# EAGLE design dials (EAGLE 9.6.2)
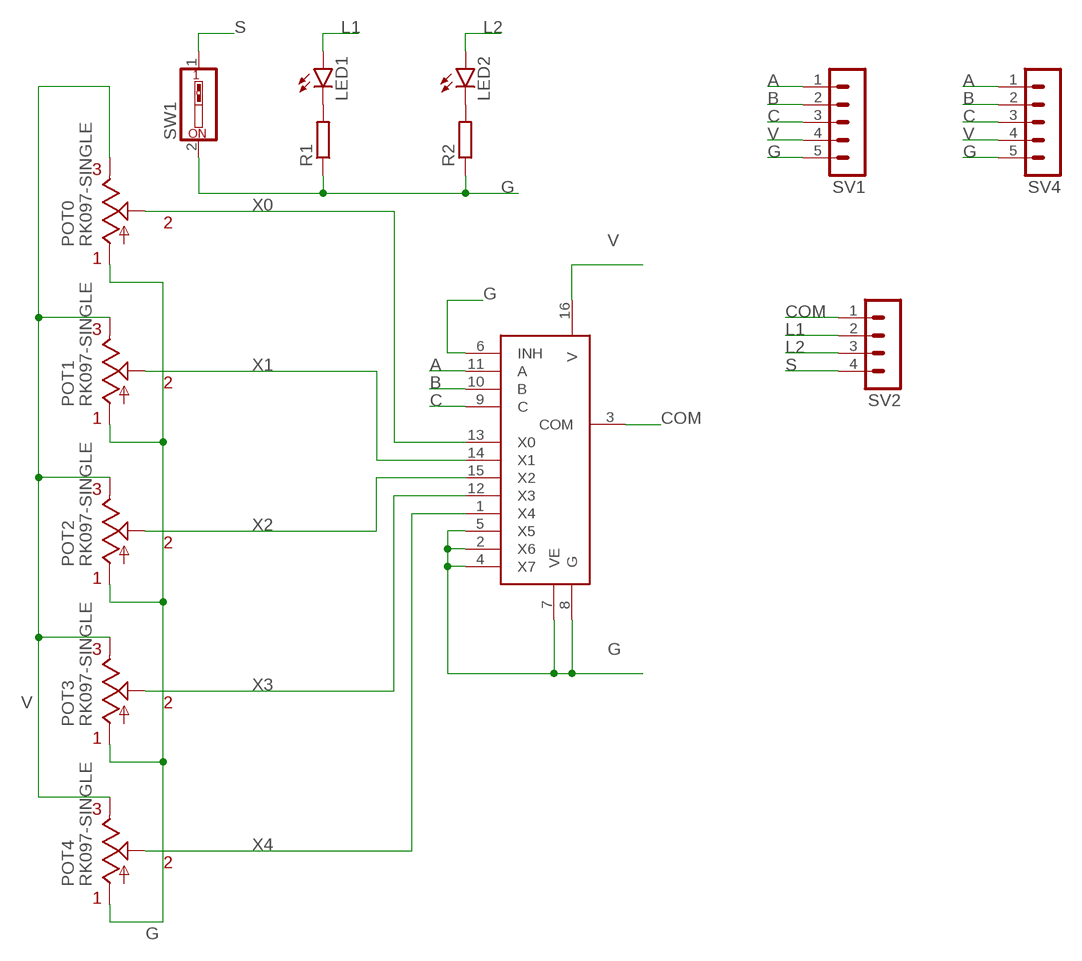
[diagram p0: schematic, sheet 1]

## Parts
LED1  LED3MM  [LED3MM]
LED2  LED3MM  [LED3MM]
POT0  RK097-SINGLE  [RK097-SINGLE-ELEMENT]
POT1  RK097-SINGLE  [RK097-SINGLE-ELEMENT]
POT2  RK097-SINGLE  [RK097-SINGLE-ELEMENT]
POT3  RK097-SINGLE  [RK097-SINGLE-ELEMENT]
POT4  RK097-SINGLE  [RK097-SINGLE-ELEMENT]
R1  R-EU_0204/7  [0204/7]
R2  R-EU_0204/7  [0204/7]
SV1  MA05-1  [MA05-1]
SV2  MA04-1  [MA04-1]
SV4  MA05-1  [MA05-1]
SW1  SW_DIP-1  [EDG-01]
U$6  MC14051  [DIP16]

## Nets
A: SV1.1 SV4.1 U$6.11(A)
B: SV1.2 SV4.2 U$6.10(B)
C: SV1.3 SV4.3 U$6.9(C)
COM: SV2.1 U$6.3(COM)
G: POT0.P$4(A) POT1.P$4(A) POT2.P$4(A) POT3.P$4(A) POT4.P$4(A) R1.1 R2.1 SV1.5 SV4.5 SW1.2 U$6.2(X6) U$6.4(X7) U$6.5(X5) U$6.6(INH) U$6.7(VE) U$6.8(G)
L1: LED1.A SV2.2
L2: LED2.A SV2.3
N$6: LED1.K(C) R1.2
N$7: LED2.K(C) R2.2
S: SV2.4 SW1.1
V: POT0.P$6(E) POT1.P$6(E) POT2.P$6(E) POT3.P$6(E) POT4.P$6(E) SV1.4 SV4.4 U$6.16(V)
X0: POT0.P$5(S) U$6.13(X0)
X1: POT1.P$5(S) U$6.14(X1)
X2: POT2.P$5(S) U$6.15(X2)
X3: POT3.P$5(S) U$6.12(X3)
X4: POT4.P$5(S) U$6.1(X4)

## Library data of the parts
LED1 LED2 = led:LED: LED OSRAM: - CHIPLED LG R971, LG N971, LY N971, LG Q971, LY Q971, LO R971, LY R971 LH N974, LH R974 LS Q976, LO Q976, LY Q976 LO Q996 - Hyper CHIPLED LW Q18S LB Q993, LB Q99A, LB R99A - SideLED LS A670, LO A670, LY A670, LG A670, LP A670 LB A673, LV A673, LT A673, LW A673 LH A674 LY A675 LS A676, LA A676, LO A676, LY A676, LW A676 LS A679, LY A679, LG A679 - Hyper Micro SIDELED® LS Y876, LA Y876, LO Y876, LY Y876 LT Y87S - SmartLED LW L88C, LW L88S LB L89C, LB L89S, LG L890 LS L89K, LO L89K, LY L89K LS L896, LA L896, LO L896, LY L896 - TOPLED LS T670, LO T670, LY T670, LG T670, LP T670 LSG T670, LSP T670, LSY T670, LOP T670, LYG T670 LG T671, LOG T671, LSG T671 LB T673, LV T673, LT T673, LW T673 LH T674 LS T676, LA T676, LO T676, LY T676, LB T676, LH T676, LSB T676, LW T676 LB T67C, LV T67C, LT T67C, LS T67K, LO T67K, LY T67K, LW E67C LS E67B, LA E67B, LO E67B, LY E67B, LB E67C, LV E67C, LT E67C LW T67C LS T679, LY T679, LG T679 LS T770, LO T770, LY T770, LG T770, LP T770 LB T773, LV T773, LT T773, LW T773 LH T774 LS E675, LA E675, LY E675, LS T675 LS T776, LA T776, LO T776, LY T776, LB T776 LHGB T686 LT T68C, LB T68C - Hyper Mini TOPLED® LB M676 - Mini TOPLED Santana® LG M470 LS M47K, LO M47K, LY M47K Source: http://www.osram.convergy.de LUXEON: - LUMILED® LXK2-PW12-R00, LXK2-PW12-S00, LXK2-PW14-U00, LXK2-PW14-V00 LXK2-PM12-R00, LXK2-PM12-S00, LXK2-PM14-U00 LXK2-PE12-Q00, LXK2-PE12-R00, LXK2-PE12-S00, LXK2-PE14-T00, LXK2-PE14-U00 LXK2-PB12-K00, LXK2-PB12-L00, LXK2-PB12-M00, LXK2-PB14-N00, LXK2-PB14-P00, LXK2-PB14-Q00 LXK2-PR12-L00, LXK2-PR12-M00, LXK2-PR14-Q00, LXK2-PR14-R00 LXK2-PD12-Q00, LXK2-PD12-R00, LXK2-PD12-S00 LXK2-PH12-R00, LXK2-PH12-S00 LXK2-PL12-P00, LXK2-PL12-Q00, LXK2-PL12-R00 Source: www.luxeon.com KINGBRIGHT: KA-3528ASYC Source: www.kingbright.com
POT0 POT1-POT4 = alps_japan_potentiometers:RK097-SINGLE: SCHEMATIC FOR POTENTIOMETER
R1 R2 = rcl:R-EU_: RESISTOR, European symbol; SPICEPREFIX: R
SV1 SV4 = con-lstb:MA05-1: PIN HEADER; OC_FARNELL: unknown; OC_NEWARK: unknown
SV2 = con-lstb:MA04-1: PIN HEADER; OC_FARNELL: unknown; OC_NEWARK: unknown
SW1 = special:SW_DIP-1: DIP SWITCH
U$6 = MC14051B:MC14051

## Board
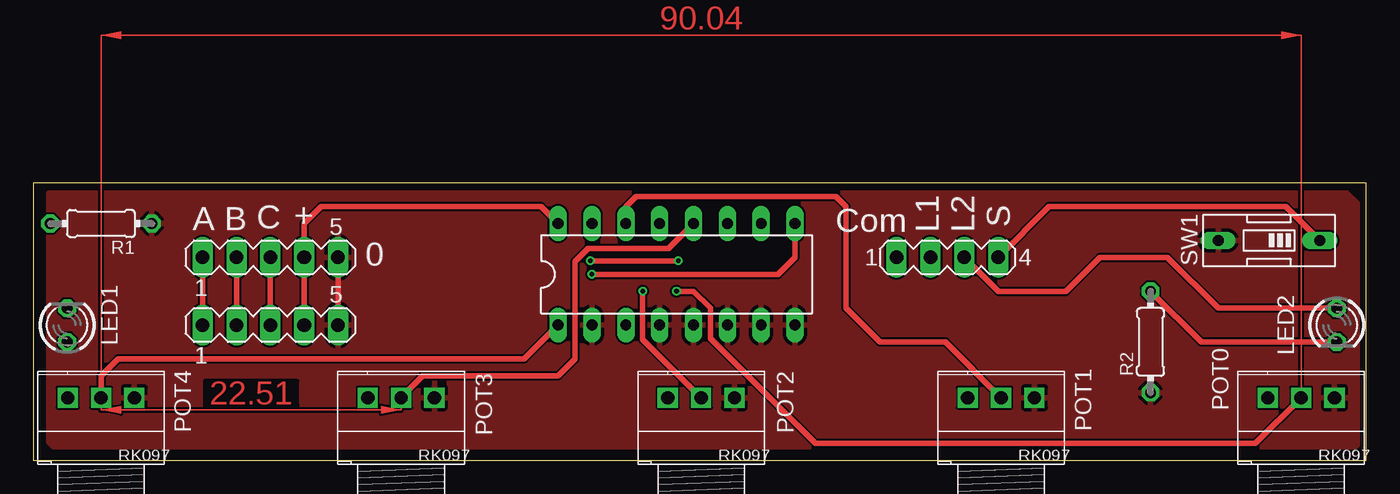
[diagram p1: board, top side]
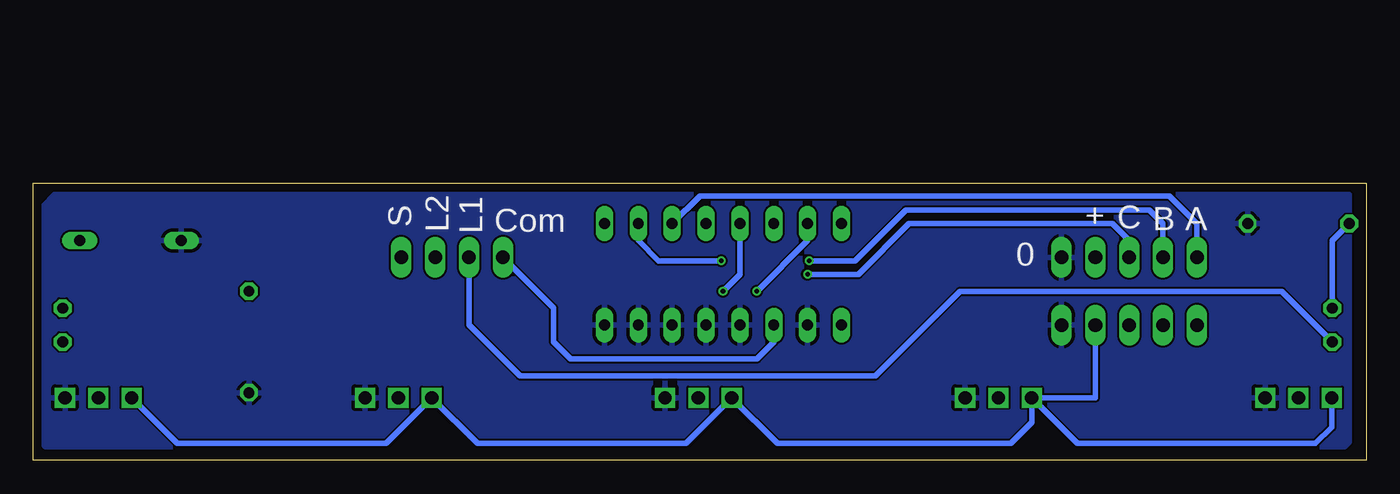
[diagram p2: board, bottom side, seen from below]

Size 100 x 20.82 mm. Coordinates in mm from the lower left corner, seen from the top.
Outline: 0,0 100,0 100,20.82 0,20.82 0,0
Copper layers (1*16): Top 0.035mm / dielectric 1.5mm / Bottom 0.035mm
Design rules "SeeedStudio_2layer_DRU_no_angle_20140221": minimum track width 6mil, minimum drill 12mil, track to track 6mil, track to pad 6mil, pad to pad 6mil, via to via 6mil, smd to smd 0mil, copper to edge 10mil, drill to drill 10mil, minimum pad ring 10mil, minimum via ring 6mil, stop-mask expansion 2mil, vias tented up to drill 100mil, thermal gap 10mil

### Footprints (pad centres in the part's own frame; a part is rotated, then mirrored left to right if it is on the bottom)
LED3MM = drill 0.813 octagon: A -1.27,0; K 1.27,0
RK097-SINGLE-ELEMENT = drill 1 pad 1.422 square: P$4 2.5,0; P$5 0,0; P$6 -2.5,0
0204/7 = drill 0.813 octagon: 1 -3.81,0; 2 3.81,0
MA05-1 = drill 1.016 long: 1 -5.08,0; 2 -2.54,0; 3 0,0; 4 2.54,0; 5 5.08,0
MA04-1 = drill 1.016 long: 1 -3.81,0; 2 -1.27,0; 3 1.27,0; 4 3.81,0
EDG-01 = drill 0.813 long: 1 0,-3.81; 2 0,3.81
DIP16 = drill 0.813 long: 1 -10.16,-3.81; 2 -7.62,-3.81; 3 -5.08,-3.81; 4 -2.54,-3.81; 5 0,-3.81; 6 2.54,-3.81; 7 5.08,-3.81; 8 7.62,-3.81; 9 7.62,3.81; 10 5.08,3.81; 11 2.54,3.81; 12 0,3.81; 13 -2.54,3.81; 14 -5.08,3.81; 15 -7.62,3.81; 16 -10.16,3.81

### Placement (x,y rotation side)
LED1  2.54,10.16 90 top
LED2  97.79,10.16 270 top
POT0  95.12,4.7 0 top
POT1  72.61,4.7 0 top
POT2  50.1,4.7 0 top
POT3  27.59,4.7 0 top
POT4  5.08,4.7 0 top
R1  5.08,17.78 180 top
R2  83.82,8.89 90 top
SV1  17.78,15.24 0 top
SV2  68.58,15.24 0 top
SV4  17.78,10.16 0 top
SW1  92.71,16.51 90 top
U$6  49.53,13.97 0 top

### Tracks (layer width: path | path; a pad name or v marks a point on that pad's centre or on a via)
A
  Top 0.406: SV1.1 SV4.1
  Bottom 0.406: SV1.1 12.7,17.78 14.77,19.85 50,19.85 U$6.11
B  (via drill 0.35)
  Top 0.406: SV1.2 SV4.2 | v48.39,14.99 v41.78,14.99
  Bottom 0.406: SV1.2 15.24,17.78 16.26,18.8 34.54,18.8 38.35,14.99 v41.78,14.99 | v48.39,14.99 53.09,14.99 54.61,16.51 U$6.10
C  (via drill 0.35)
  Top 0.406: SV1.3 SV4.3 | v41.91,13.97 55.88,13.97 57.15,15.24 U$6.9
  Bottom 0.406: SV1.3 17.78,16.51 19.05,17.78 34.29,17.78 38.1,13.97 v41.91,13.97
COM
  Bottom 0.406: SV2.1 60.96,11.43 60.96,8.89 59.69,7.62 45.72,7.62 44.45,8.89 U$6.3
G
  Top 0.406: SV1.5 SV4.5
  pour Bottom: 1.27,19.94 98.42,19.94 99.19,19.18 99.19,1.14 99.06,1.02 1.65,1.02 1.27,1.4
  pour Top: 1.14,20.07 98.55,20.07 99.31,19.3 99.31,1.14 99.19,1.02 1.52,1.02 1.14,1.4
L1
  Bottom 0.406: LED1.A 6.35,12.7 30.48,12.7 36.83,6.35 63.5,6.35 67.31,10.16 SV2.2
L2
  Top 0.406: SV2.3 72.39,12.7 77.47,12.7 80.01,15.24 85.09,15.24 88.9,11.43 LED2.A
N$6
  Bottom 0.406: R1.2 2.54,16.51 LED1.K
N$7
  Top 0.406: LED2.K 87.63,8.89 R2.2
S
  Top 0.406: SW1.1 93.98,19.05 76.2,19.05 SV2.4
V
  Top 0.406: SV4.4 SV1.4 20.32,17.78 21.59,19.05 38.1,19.05 U$6.16
  Bottom 0.406: SV4.4 20.32,4.7 POT3.P$6 | POT4.P$6 2.58,2.5 3.81,1.27 21.66,1.27 POT3.P$6 | POT3.P$6 25.09,2.85 26.67,1.27 44.17,1.27 POT2.P$6 51.03,1.27 66.68,1.27 POT1.P$6 73.54,1.27 89.19,1.27 POT0.P$6
X0  (via drill 0.35)
  Top 0.406: v48.26,12.7 49.53,12.7 50.8,11.43 50.8,9.14 58.67,1.27 91.69,1.27 POT0.P$5
  Bottom 0.406: U$6.13 46.99,13.97 v48.26,12.7
X1
  Top 0.254: 44.45,19.05 U$6.14
  Top 0.406: POT1.P$5 68.42,8.89 63.5,8.89 60.96,11.43 60.96,19.05 60.21,19.8 45.2,19.8 44.45,19.05
X2  (via drill 0.35)
  Top 0.406: POT2.P$5 45.72,9.08 v45.72,12.7
  Bottom 0.254: 41.91,16.51 U$6.15
  Bottom 0.406: v45.72,12.7 41.91,16.51
X3
  Top 0.406: POT3.P$5 27.59,4.73 29.21,6.35 39.37,6.35 40.64,7.62 40.64,14.94 41.63,15.92 47.67,15.92 U$6.12
X4
  Top 0.406: POT4.P$5 5.08,6.35 6.35,7.62 36.83,7.62 U$6.1
(copper drawn outside any net)
  shapes: Top area x2

### Text on the board
tPlace: + | S | A | B | C | Com | L1 | L2 | 0
bPlace: L1 | L2 | S | + | A | B | C | Com | 0